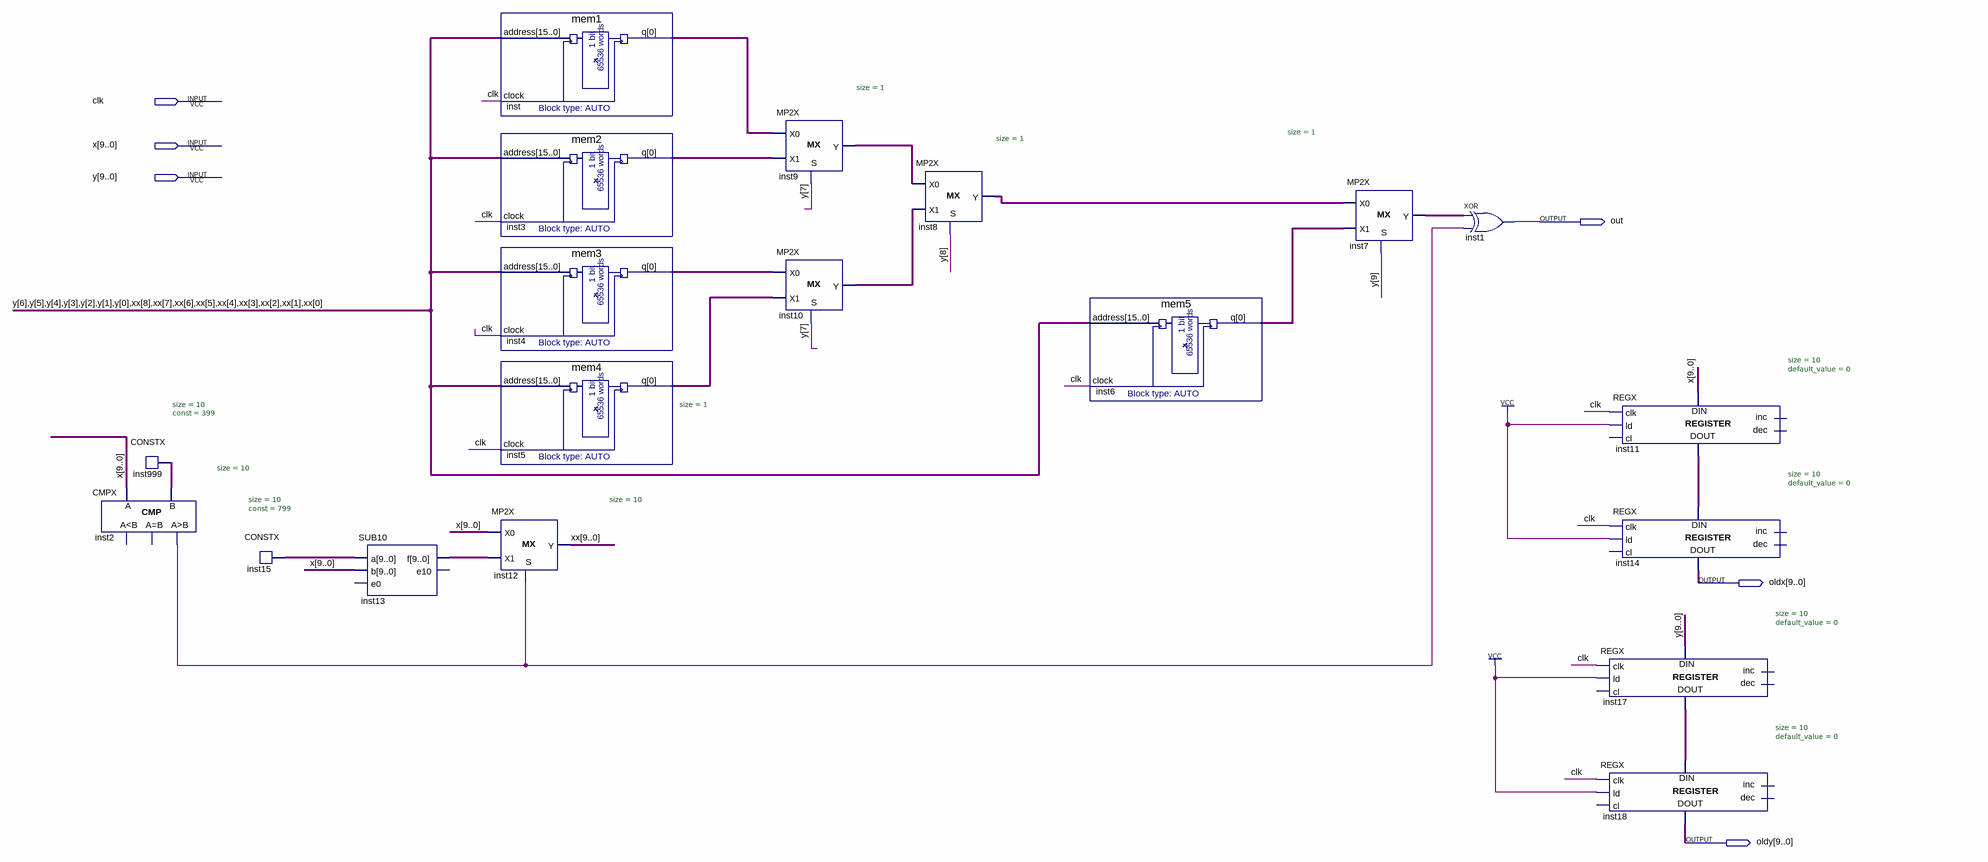
[diagram p0: schematic sheet]
// Quartus schematic MEM.bdf as structural Verilog: 19 symbols, 6 pins
module MEM (
  input  clk,
  input  [9:0] x,
  input  [9:0] y,
  output out,
  output [9:0] oldx,
  output [9:0] oldy
);

  wire inst2_gr, inst3_q, inst4_q, inst5_q, inst6_q, inst7_y, inst8_y, inst9_y, inst10_y, inst_q;
  wire [9:0] inst11_data_out, inst13_f, inst15_data, inst17_data_out, inst999_data, xx;

  CMPX #(.size(10)) inst2 (.A(x), .B(inst999_data), .gr(inst2_gr));  // open: ls, eq
  CONSTX #(.size(10), .\const (399)) inst999 (.data(inst999_data));
  CONSTX #(.size(10), .\const (799)) inst15 (.data(inst15_data));
  SUB10 inst13 (.a(inst15_data), .b(x), .f(inst13_f));  // open: e0, e10
  mem1 inst (.address({y[6:0], xx[8:0]}), .clock(clk), .q(inst_q));
  mem2 inst3 (.address({y[6:0], xx[8:0]}), .clock(clk), .q(inst3_q));
  mem3 inst4 (.address({y[6:0], xx[8:0]}), .clock(clk), .q(inst4_q));
  mem4 inst5 (.address({y[6:0], xx[8:0]}), .clock(clk), .q(inst5_q));
  MP2X #(.size(10)) inst12 (.S(inst2_gr), .X0(x), .X1(inst13_f), .Y(xx));
  MP2X #(.size(1)) inst9 (.S(y[7]), .X0(inst_q), .X1(inst3_q), .Y(inst9_y));
  MP2X #(.size(1)) inst10 (.S(y[7]), .X0(inst4_q), .X1(inst5_q), .Y(inst10_y));
  MP2X #(.size(1)) inst8 (.S(y[8]), .X0(inst9_y), .X1(inst10_y), .Y(inst8_y));
  mem5 inst6 (.address({y[6:0], xx[8:0]}), .clock(clk), .q(inst6_q));
  MP2X #(.size(1)) inst7 (.S(y[9]), .X0(inst8_y), .X1(inst6_q), .Y(inst7_y));
  xor inst1 (out, inst7_y, inst2_gr);
  REGX #(.size(10), .default_value(0)) inst11 (
    .clk(clk), .ld(1'b1), .data_in(x), .data_out(inst11_data_out));  // open: cl, inc, dec
  REGX #(.size(10), .default_value(0)) inst14 (
    .clk(clk), .ld(1'b1), .data_in(inst11_data_out), .data_out(oldx));  // open: cl, inc, dec
  REGX #(.size(10), .default_value(0)) inst17 (
    .clk(clk), .ld(1'b1), .data_in(y), .data_out(inst17_data_out));  // open: cl, inc, dec
  REGX #(.size(10), .default_value(0)) inst18 (
    .clk(clk), .ld(1'b1), .data_in(inst17_data_out), .data_out(oldy));  // open: cl, inc, dec
endmodule
